# EAGLE design RG Matrix Driver (EAGLE 7.0.0)
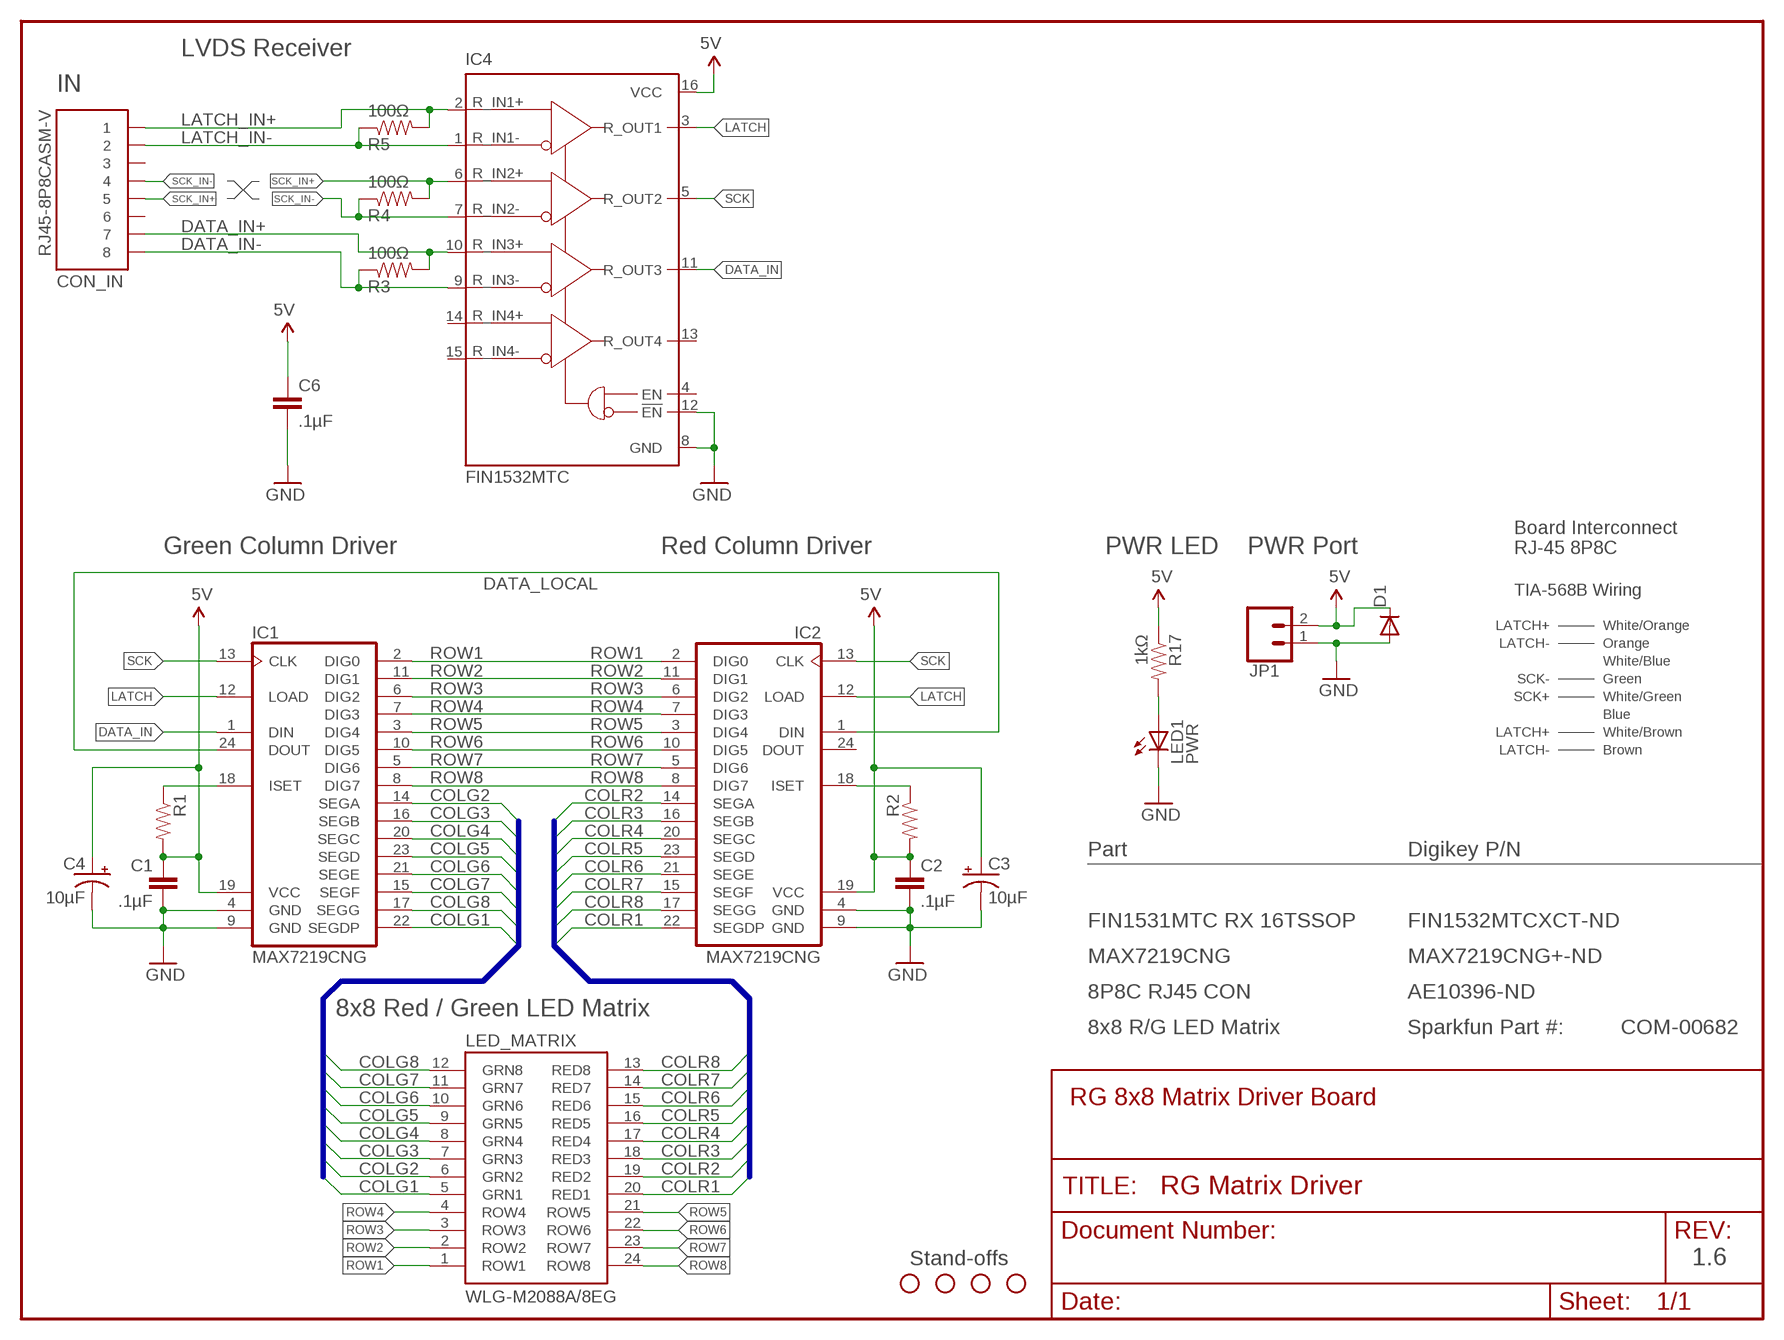
[diagram p0: schematic, sheet 1]

## Parts
C1  .1µF  CAP1206  [1206]
C2  .1µF  CAP1206  [1206]
C3  10µF  CAP_POLPTH2  [CPOL-RADIAL-10UF-25V]
C4  10µF  CAP_POLPTH2  [CPOL-RADIAL-10UF-25V]
C6  .1µF  CAP1206  [1206]
CON_IN  RJ45-8P8CASM-V  [RJ45-8P8C-ASM]
D1  DIODEPTH  [DIODE-1N4001]
IC1  MAX7219CNG  [DIL24-3]
IC2  MAX7219CNG  [DIL24-3]
IC4  FIN1532MTC  [TSSOP-16]
JP1  PWR  M02  [1X02_PC_SMD]
JP3  STAND-OFF  [STAND-OFF]
JP4  STAND-OFF  [STAND-OFF]
JP5  STAND-OFF  [STAND-OFF]
JP6  STAND-OFF  [STAND-OFF]
LED1  PWR  LED1206  [LED-1206]
LED_MATRIX  WLG-M2088A/8EG  [WLG-M2088A/8EG]
R1  RESISTOR1206  [1206]
R2  RESISTOR1206  [1206]
R3  100Ω  RESISTOR1206  [1206]
R4  100Ω  RESISTOR1206  [1206]
R5  100Ω  RESISTOR1206  [1206]
R17  1kΩ  RESISTOR1206  [1206]

## Nets
5V: C1.1 C2.1 C3.1(+) C4.1(+) C6.1 D1.C IC1.19(VCC) IC2.19(VCC) IC4.16(VCC) JP1.2 R1.2 R2.2 R17.1
COLG1: IC1.22(SEGDP) LED_MATRIX.5(GRN1)
COLG2: IC1.14(SEGA) LED_MATRIX.6(GRN2)
COLG3: IC1.16(SEGB) LED_MATRIX.7(GRN3)
COLG4: IC1.20(SEGC) LED_MATRIX.8(GRN4)
COLG5: IC1.23(SEGD) LED_MATRIX.9(GRN5)
COLG6: IC1.21(SEGE) LED_MATRIX.10(GRN6)
COLG7: IC1.15(SEGF) LED_MATRIX.11(GRN7)
COLG8: IC1.17(SEGG) LED_MATRIX.12(GRN8)
COLR1: IC2.22(SEGDP) LED_MATRIX.20(RED1)
COLR2: IC2.14(SEGA) LED_MATRIX.19(RED2)
COLR3: IC2.16(SEGB) LED_MATRIX.18(RED3)
COLR4: IC2.20(SEGC) LED_MATRIX.17(RED4)
COLR5: IC2.23(SEGD) LED_MATRIX.16(RED5)
COLR6: IC2.21(SEGE) LED_MATRIX.15(RED6)
COLR7: IC2.15(SEGF) LED_MATRIX.14(RED7)
COLR8: IC2.17(SEGG) LED_MATRIX.13(RED8)
DATA_IN: IC1.1(DIN) IC4.11(R_OUT3)
DATA_IN+: CON_IN.7 IC4.10(R_IN3+) R3.2
DATA_IN-: CON_IN.8 IC4.9(R_IN3-) R3.1
DATA_LOCAL: IC1.24(DOUT) IC2.1(DIN)
GISET: IC1.18(ISET) R1.1
GND: C1.2 C2.2 C3.2(-) C4.2(-) C6.2 D1.A IC1.4(GND) IC1.9(GND) IC2.4(GND) IC2.9(GND) IC4.8(GND) IC4.12(!EN) JP1.1 LED1.C
LATCH: IC1.12(LOAD) IC2.12(LOAD) IC4.3(R_OUT1)
LATCH_IN+: CON_IN.1 IC4.2(R_IN1+) R5.2
LATCH_IN-: CON_IN.2 IC4.1(R_IN1-) R5.1
LEDPWR: LED1.A R17.2
RISET: IC2.18(ISET) R2.1
ROW1: IC1.2(DIG0) IC2.2(DIG0) LED_MATRIX.1(ROW1)
ROW2: IC1.11(DIG1) IC2.11(DIG1) LED_MATRIX.2(ROW2)
ROW3: IC1.6(DIG2) IC2.6(DIG2) LED_MATRIX.3(ROW3)
ROW4: IC1.7(DIG3) IC2.7(DIG3) LED_MATRIX.4(ROW4)
ROW5: IC1.3(DIG4) IC2.3(DIG4) LED_MATRIX.21(ROW5)
ROW6: IC1.10(DIG5) IC2.10(DIG5) LED_MATRIX.22(ROW6)
ROW7: IC1.5(DIG6) IC2.5(DIG6) LED_MATRIX.23(ROW7)
ROW8: IC1.8(DIG7) IC2.8(DIG7) LED_MATRIX.24(ROW8)
SCK: IC1.13(CLK) IC2.13(CLK) IC4.5(R_OUT2)
SCK_IN+: CON_IN.5 IC4.6(R_IN2+) R4.2
SCK_IN-: CON_IN.4 IC4.7(R_IN2-) R4.1
Unconnected: CON_IN.3 CON_IN.6 IC2.24(DOUT) IC4.4(EN) IC4.13(R_OUT4) IC4.14(R_OUT4+) IC4.15(R_OUT4-)

## Buses
COLG[1..8],GRNCOL
COLR[1..8],REDCOL

## Notes on the sheet
- LVDS Receiver
- IN
- Green Column Driver | Red Column Driver | PWR LED | PWR Port
- Board Interconnect
  RJ-45 8P8C
- TIA-568B Wiring
- LATCH+ | White/Orange
- LATCH- | Orange
- White/Blue
- SCK- | Green
- SCK+ | White/Green
- Blue
- LATCH+ | White/Brown
- LATCH- | Brown
- Part | Digikey P/N
- FIN1531MTC RX 16TSSOP | FIN1532MTCXCT-ND
- MAX7219CNG | MAX7219CNG+-ND
- 8P8C RJ45 CON | AE10396-ND
- 8x8 Red / Green LED Matrix
- 8x8 R/G LED Matrix | Sparkfun Part #: | COM-00682
- RG 8x8 Matrix Driver Board
- Stand-offs | 1.6

## Library data of the parts
C1 C2 C6 = SparkFun-Capacitors:CAP: Capacitor Standard 0603 ceramic capacitor, and 0.1" leaded capacitor.
C3 C4 = SparkFun:CAP_POL: Capacitor Polarized These are standard SMD and PTH capacitors. Normally 10uF, 47uF, and 100uF in electrolytic and tantalum varieties. Always verify the external diameter of the through hole cap, it varies with capacity, voltage, and manufacturer. The EIA devices should be standard.
CON_IN = GetOffMyHack:RJ45-8P8C
D1 = SparkFun-DiscreteSemi:DIODE: Diode These are standard reverse protection diodes and small signal diodes. SMA package can handle up to about 1A. SOD-323 can handle about 200mA. What the SOD-323 package when ordering, there are some mfgs out there that are 5-pin packages.
IC1 IC2 = maxim:MAX7219CNG: LED DISPLAY DRIVER; MF: MAXIM; MPN: MAX7219CNG; OC_FARNELL: 1523914; OC_NEWARK: 34C4018
IC4 = GetOffMyHack:FIN1532: 5V Quad LVDS High Speed Differential Receiver
JP1 = GetOffMyHack:M02: Header 2 Standard 2-pin 0.1" header. Use with straight break away headers (SKU : PRT-00116), right angle break away headers (PRT-00553), swiss pins (PRT-00743), machine pins (PRT-00117), and female headers (PRT-00115). Molex polarized connector foot print use with SKU : PRT-08233 with associated crimp pins and housings.
JP3-JP6 = SparkFun:STAND-OFF: Stand Off This is the mechanical footprint for a #4 phillips button head screw. Use the keepout ring to avoid running the screw head into surrounding components. SKU : PRT-00447
LED1 = SparkFun:LED: LEDs Standard schematic elements and footprints for 5mm, 3mm, 1206, and 0603 sized LEDs. 5mm - Spark Fun Electronics SKU : COM-00529 (and others)
LED_MATRIX = led-matrix-v3:WLG-M2088A/8EG: LED Matrix - Dual Color (Red + Green) - Medium sku: COM-00682 0.33 x 2 x 2"
R1-R5 = SparkFun-Resistors:RESISTOR: Resistor Basic schematic elements and footprints for 0603, 1206, and PTH resistors.
R17 = SparkFun:RESISTOR: Resistor Basic schematic elements and footprints for 0603, 1206, and PTH resistors.

## Board
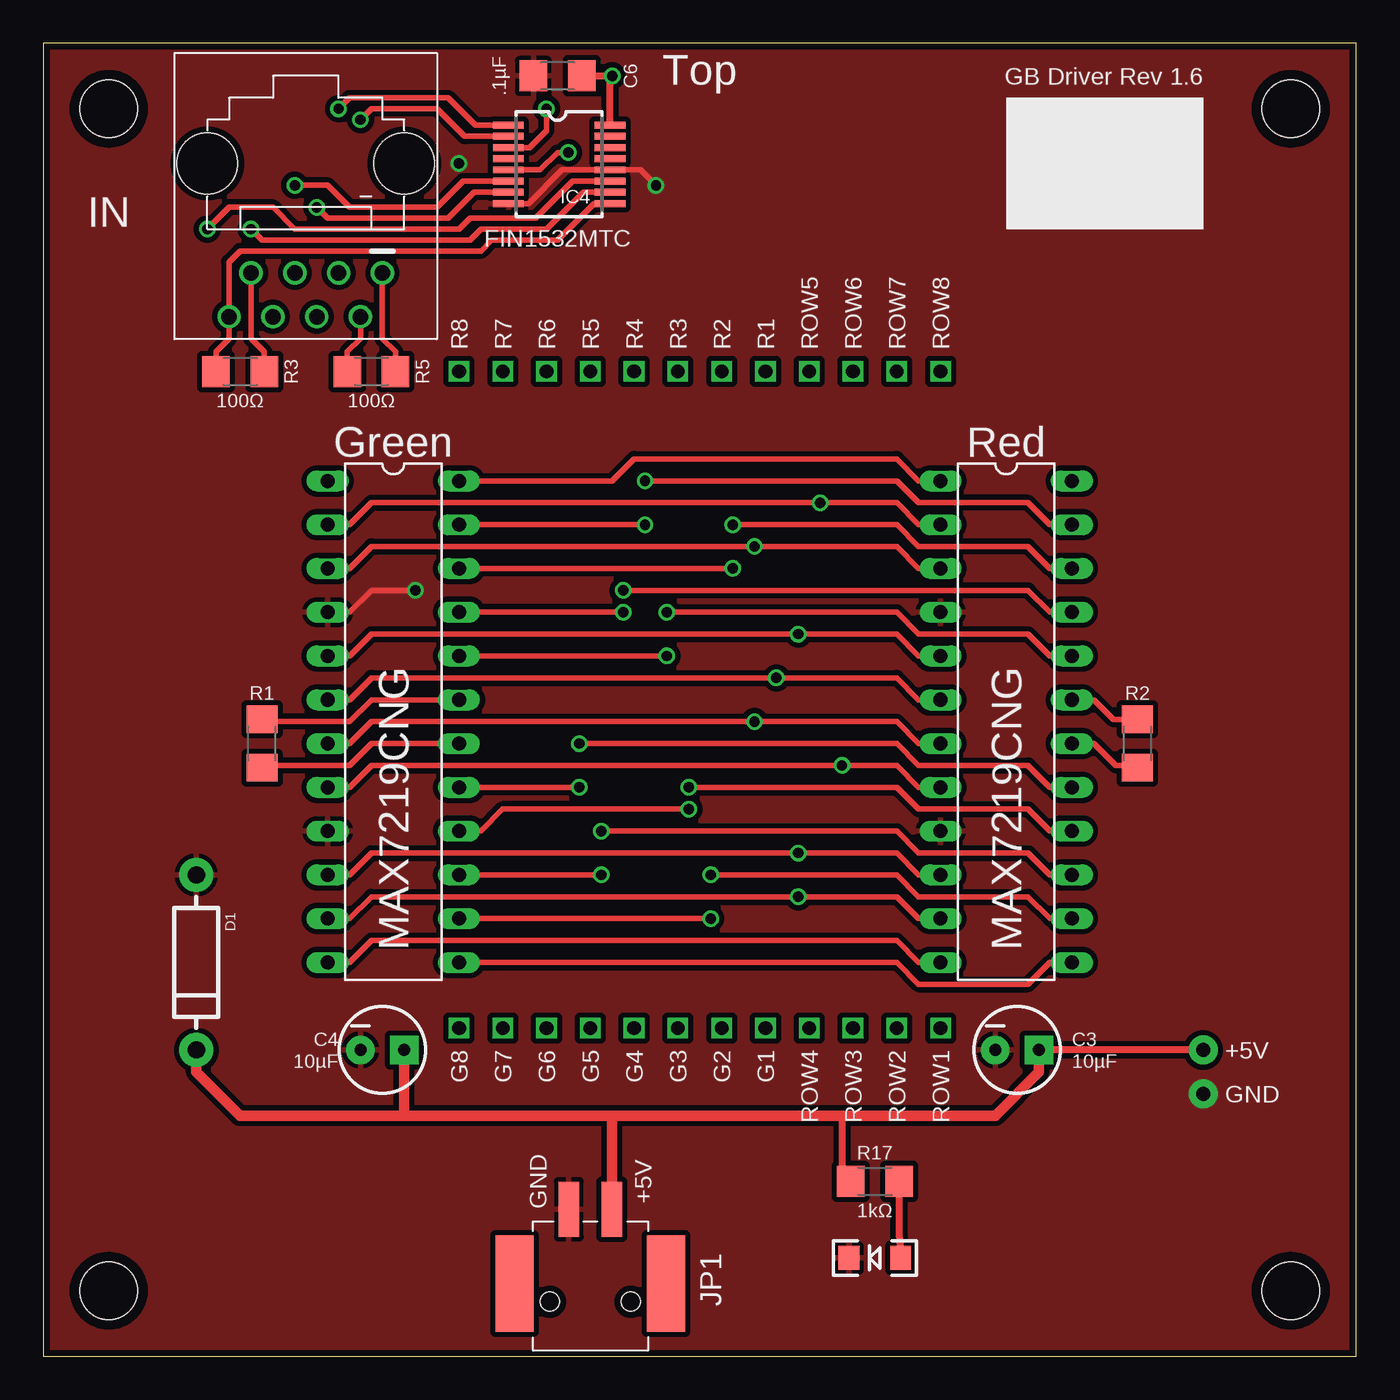
[diagram p1: board, top side]
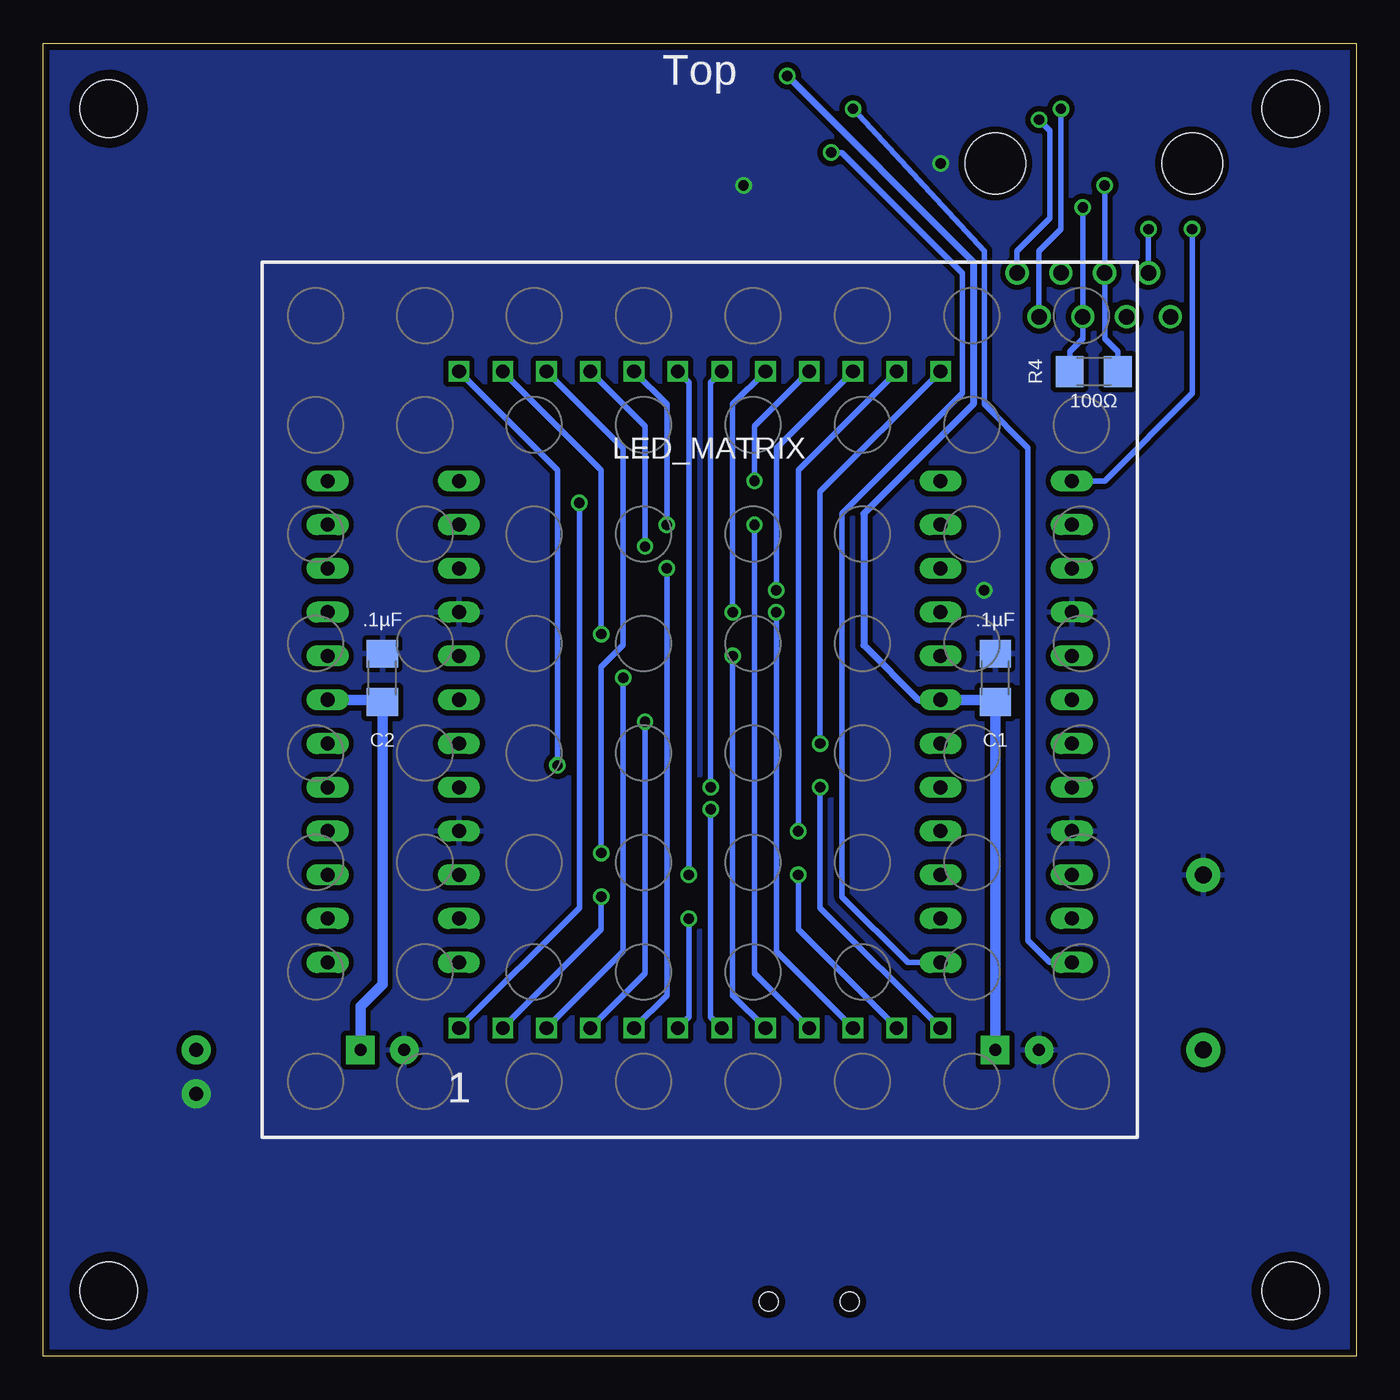
[diagram p2: board, bottom side, seen from below]

Size 76.2 x 76.2 mm. Coordinates in mm from the lower left corner, seen from the top.
Outline: 0,0 76.2,0 76.2,76.2 0,76.2 0,0
Copper layers (1*16): Top 0.0356mm / dielectric 1.5011mm / Bottom 0.0356mm
Design rules "LaenPCBOrder": minimum track width 6mil, minimum drill 13mil, track to track 6mil, track to pad 6mil, pad to pad 6mil, via to via 6mil, smd to smd 6mil, copper to edge 15mil, drill to drill 6mil, minimum pad ring 7mil, minimum via ring 7mil, stop-mask expansion 3mil, vias tented up to drill 0mil, thermal gap 10mil

### Footprints (pad centres in the part's own frame; a part is rotated, then mirrored left to right if it is on the bottom)
1206 = smd 1.6 x 1.8: 1 -1.4,0; 2 1.4,0
CPOL-RADIAL-10UF-25V = drill 0.7 pad 1.651 square: 1 1.27,0 | drill 0.7 pad 1.651: 2 -1.27,0
RJ45-8P8C-ASM = drill 0.9: 1 -4.445,4.445; 2 -3.175,6.985; 3 -1.905,4.445; 4 -0.635,6.985; 5 0.635,4.445; 6 1.905,6.985; 7 3.175,4.445; 8 4.445,6.985 | hole 3.5: 5.715,-1.905; -5.715,-1.905
DIODE-1N4001 = drill 1 pad 1.981: A -5.08,0; C 5.08,0
DIL24-3 = drill 0.813 long: 1 -13.97,-3.81; 2 -11.43,-3.81; 3 -8.89,-3.81; 4 -6.35,-3.81; 5 -3.81,-3.81; 6 -1.27,-3.81; 7 1.27,-3.81; 8 3.81,-3.81; 9 6.35,-3.81; 10 8.89,-3.81; 11 11.43,-3.81; 12 13.97,-3.81; 13 13.97,3.81; 14 11.43,3.81; 15 8.89,3.81; 16 6.35,3.81; 17 3.81,3.81; 18 1.27,3.81; 19 -1.27,3.81; 20 -3.81,3.81; 21 -6.35,3.81; 22 -8.89,3.81; 23 -11.43,3.81; 24 -13.97,3.81
TSSOP-16 = smd 0.4 x 1.78: 1 -2.225,-2.85; 2 -1.575,-2.85; 3 -0.925,-2.85; 4 -0.275,-2.85; 5 0.375,-2.85; 6 1.025,-2.85; 7 1.675,-2.85; 8 2.325,-2.85; 9 2.325,3.05; 10 1.675,3.05; 11 1.025,3.05; 12 0.375,3.05; 13 -0.275,3.05; 14 -0.925,3.05; 15 -1.575,3.05; 16 -2.225,3.05
1X02_PC_SMD = smd 1.2 x 3.2: 1 -1.25,3.45; 2 1.25,3.45 | smd 2.2 x 5.6: P$3 4.4,-0.85; P$4 -4.4,-0.85 | hole 1.1: -2.35,-1.9; 2.35,-1.9
STAND-OFF = hole 3.302: 0,0
LED-1206 = smd 1.2 x 1.4: A -1.5,0; C 1.5,0
WLG-M2088A/8EG = drill 0.8 square: 1 -13.97,-19.05; 2 -11.43,-19.05; 3 -8.89,-19.05; 4 -6.35,-19.05; 5 -3.81,-19.05; 6 -1.27,-19.05; 7 1.27,-19.05; 8 3.81,-19.05; 9 6.35,-19.05; 10 8.89,-19.05; 11 11.43,-19.05; 12 13.97,-19.05; 13 13.97,19.05; 14 11.43,19.05; 15 8.89,19.05; 16 6.35,19.05; 17 3.81,19.05; 18 1.27,19.05; 19 -1.27,19.05; 20 -3.81,19.05; 21 -6.35,19.05; 22 -8.89,19.05; 23 -11.43,19.05; 24 -13.97,19.05

### Placement (x,y rotation side)
C1  20.95,39.37 90 bottom
C2  56.52,39.37 90 bottom
C3  56.52,17.78 0 top
C4  19.68,17.78 0 top
C6  29.84,74.3 180 top
CON_IN  15.24,67.31 180 top
D1  8.89,22.86 270 top
IC1  20.32,36.83 270 top
IC2  55.88,36.83 270 top
IC4  29.84,69.22 270 top
JP1  31.75,5.08 0 top
JP3  3.81,3.81 0 top
JP4  72.39,72.39 0 top
JP5  3.81,72.39 0 top
JP6  72.39,3.81 0 top
LED1  48.26,5.71 180 top
LED_MATRIX  38.1,38.1 0 bottom
R1  12.7,35.56 90 top
R2  63.5,35.56 90 top
R3  11.43,57.15 0 top
R4  15.24,57.15 0 bottom
R5  19.05,57.15 0 top
R17  48.26,10.16 0 top

### Tracks (layer width: path | path; a pad name or v marks a point on that pad's centre or on a via)
5V  (via drill 0.6, 0.8 pad 1.68)
  Top 0.305: IC1.19 19.05,38.1 17.78,36.83 12.83,36.83 R1.2 | R2.2 62.1,36.96 60.96,38.1 IC2.19
  Top 0.406: IC4.16 32.9,74.17 v33.02,74.3 C6.1 | 46.35,13.97 46.35,10.66 R17.1 | v67.31,17.78 C3.1
  Top 0.61: C3.1 57.78,16.51 55.24,13.97 46.35,13.97 31.75,13.97 | 20.95,13.97 C4.1 | JP1.2 33,13.95 31.75,13.97 | 31.75,13.97 11.43,13.97 8.89,16.51 D1.C
  Bottom 0.406: 55.88,38.1 56.38,38.1 C2.1 | v33.02,74.3 22.23,63.5 22.23,55.24 28.57,48.9 28.57,41.27 25.4,38.1 IC1.19
  Bottom 0.61: C4.1 C1.1 21.09,38.1 IC1.19 | C3.1 57.78,20.32 56.52,21.59 C2.1 56.65,38.1 IC2.19
COLG1  (via drill 0.6)
  Top 0.305: v40.01,45.72 IC1.22
  Bottom 0.305: LED_MATRIX.5 40.01,20.95 v40.01,45.72
COLG2  (via drill 0.6)
  Top 0.305: v38.73,25.4 IC1.14
  Bottom 0.305: LED_MATRIX.6 38.73,19.68 v38.73,25.4
COLG3  (via drill 0.6)
  Top 0.305: v37.47,31.75 26.67,31.75 25.4,30.48 IC1.16
  Bottom 0.305: LED_MATRIX.7 37.47,19.68 v37.47,31.75
COLG4  (via drill 0.6)
  Top 0.305: v36.2,40.64 IC1.20
  Bottom 0.305: LED_MATRIX.8 36.2,20.95 v36.2,40.64
COLG5  (via drill 0.6)
  Top 0.305: v34.92,48.26 IC1.23
  Bottom 0.305: LED_MATRIX.9 34.92,22.23 v34.92,48.26
COLG6  (via drill 0.6)
  Top 0.305: v33.66,43.18 IC1.21
  Bottom 0.305: LED_MATRIX.10 33.66,23.5 v33.66,43.18
COLG7  (via drill 0.6)
  Top 0.305: v32.38,27.94 IC1.15
  Bottom 0.305: LED_MATRIX.11 32.38,24.77 v32.38,27.94
COLG8  (via drill 0.6)
  Top 0.305: v31.11,33.02 IC1.17
  Bottom 0.305: LED_MATRIX.12 31.11,26.04 v31.11,33.02
COLR1  (via drill 0.6)
  Top 0.305: IC2.22 58.42,45.72 57.15,46.99 50.8,46.99 49.53,48.26 v40.01,48.26
  Bottom 0.305: LED_MATRIX.20 40.01,55.24 v40.01,48.26
COLR2  (via drill 0.6)
  Top 0.305: v38.73,27.94 49.53,27.94 50.8,26.67 57.15,26.67 58.42,25.4 IC2.14
  Bottom 0.305: LED_MATRIX.19 38.73,56.52 v38.73,27.94
COLR3  (via drill 0.6)
  Top 0.305: v37.47,33.02 49.53,33.02 50.8,31.75 57.15,31.75 58.42,30.48 IC2.16
  Bottom 0.305: LED_MATRIX.18 37.47,56.52 v37.47,33.02
COLR4  (via drill 0.6)
  Top 0.305: v36.2,43.18 49.53,43.18 50.8,41.91 57.15,41.91 58.42,40.64 IC2.20
  Bottom 0.305: v36.2,43.18 36.2,55.24 LED_MATRIX.17
COLR5  (via drill 0.6)
  Top 0.305: IC2.23 58.42,48.26 57.15,49.53 50.8,49.53 49.53,50.8 v34.92,50.8
  Bottom 0.305: LED_MATRIX.16 34.92,53.98 v34.92,50.8
COLR6  (via drill 0.6)
  Top 0.305: IC2.21 58.42,43.18 57.15,44.45 v33.66,44.45
  Bottom 0.305: LED_MATRIX.15 33.66,52.7 v33.66,44.45
COLR7  (via drill 0.6)
  Top 0.305: v32.38,30.48 49.53,30.48 50.8,29.21 57.15,29.21 58.42,27.94 IC2.15
  Bottom 0.305: LED_MATRIX.14 32.38,51.44 v32.38,30.48
COLR8  (via drill 0.6)
  Top 0.305: v31.11,35.56 49.53,35.56 50.8,34.29 57.15,34.29 58.42,33.02 IC2.17
  Bottom 0.305: LED_MATRIX.13 31.11,50.16 v31.11,35.56
DATA_IN  (via drill 0.6)
  Top 0.305: IC4.11 30.73,68.19 28.57,66.04 24.77,66.04 24.13,65.41 14.61,65.41 13.34,66.67 10.79,66.67 v9.53,65.41
  Bottom 0.305: IC1.1 14.61,50.8 9.53,55.88 v9.53,65.41
DATA_IN+  (via drill 0.6)
  Top 0.305: R3.2 12.83,58.29 12.06,59.05 CON_IN.7 | IC4.10 31.34,67.54 29.21,65.41 25.4,65.41 24.77,64.77 12.7,64.77 v12.06,65.41
  Bottom 0.305: CON_IN.7 v12.06,65.41
DATA_IN-
  Top 0.305: R3.1 10.03,58.29 10.79,59.05 CON_IN.8 10.79,63.5 11.43,64.14 25.4,64.14 26.04,64.77 29.84,64.77 31.96,66.89 IC4.9
DATA_LOCAL
  Top 0.305: IC1.24 33.02,50.8 34.29,52.07 49.53,52.07 50.8,50.8 IC2.1
GISET
  Top 0.305: IC1.18 19.05,35.56 17.78,34.29 12.83,34.29 R1.1
GND  (via drill 0.6, 0.8 pad 1.68)
  Top 0.305: IC4.8 28.16,66.89 30.11,68.84 IC4.12 34.66,68.84 v35.56,67.94 | IC1.4 17.78,43.18 19.05,44.45 v21.59,44.45
  other vias: 67.31,15.24 24.13,69.22
  pour Top (isolate 0.305): 0,76.2 0,0 76.2,0 76.2,76.2
  pour Bottom (isolate 0.305): 0,76.2 0,0 76.2,0 76.2,76.2
LATCH  (via drill 0.6)
  Top 0.305: IC1.12 17.78,22.86 19.05,24.13 49.53,24.13 50.8,22.86 IC2.12 | IC4.3 28.23,70.14 29.21,71.12 v29.21,72.39
  Bottom 0.305: IC1.12 17.78,22.86 19.05,24.13 19.05,52.7 21.59,55.24 21.59,64.14 v29.21,72.39
LATCH_IN+  (via drill 0.6)
  Top 0.305: R5.2 20.45,58.29 19.68,59.05 CON_IN.1 | IC4.2 24.46,70.79 22.86,72.39 19.05,72.39 v18.41,71.75
  Bottom 0.305: v18.41,71.75 17.78,71.12 17.78,66.04 19.68,64.14 CON_IN.1
LATCH_IN-  (via drill 0.6)
  Top 0.305: R5.1 17.65,58.29 18.41,59.05 CON_IN.2 | v17.14,72.39 17.78,73.03 23.5,73.03 25.08,71.44 IC4.1
  Bottom 0.305: CON_IN.2 18.41,64.14 17.14,65.41 v17.14,72.39
LEDPWR
  Top 0.406: R17.2 49.66,7.08 LED1.A
RISET
  Top 0.305: IC2.18 60.96,35.56 62.23,34.29 63.37,34.29 R2.1
ROW1  (via drill 0.6)
  Top 0.305: IC1.2 17.78,48.26 19.05,49.53 v45.09,49.53 49.53,49.53 50.8,48.26 IC2.2
  Bottom 0.305: LED_MATRIX.1 45.09,26.04 v45.09,49.53
ROW2  (via drill 0.6)
  Top 0.305: IC1.11 17.78,25.4 19.05,26.67 v43.81,26.67 49.53,26.67 50.8,25.4 IC2.11
  Bottom 0.305: LED_MATRIX.2 43.81,24.77 v43.81,26.67
ROW3  (via drill 0.6)
  Top 0.305: IC1.6 17.78,38.1 19.05,39.37 v42.55,39.37 49.53,39.37 50.8,38.1 IC2.6
  Bottom 0.305: LED_MATRIX.3 42.55,23.5 v42.55,39.37
ROW4  (via drill 0.6)
  Top 0.305: IC1.7 17.78,35.56 19.05,36.83 v41.27,36.83 49.53,36.83 50.8,35.56 IC2.7
  Bottom 0.305: LED_MATRIX.4 41.27,22.23 v41.27,36.83
ROW5  (via drill 0.6)
  Top 0.305: IC1.3 17.78,45.72 19.05,46.99 v41.27,46.99 49.53,46.99 50.8,45.72 IC2.3
  Bottom 0.305: LED_MATRIX.21 41.27,53.98 v41.27,46.99
ROW6  (via drill 0.6)
  Top 0.305: IC1.10 17.78,27.94 19.05,29.21 v43.81,29.21 49.53,29.21 50.8,27.94 IC2.10
  Bottom 0.305: LED_MATRIX.22 42.55,52.7 42.55,41.27 43.81,40.01 v43.81,29.21
ROW7  (via drill 0.6)
  Top 0.305: IC1.5 17.78,40.64 19.05,41.91 v43.81,41.91 49.53,41.91 50.8,40.64 IC2.5
  Bottom 0.305: LED_MATRIX.23 43.81,51.44 v43.81,41.91
ROW8  (via drill 0.6)
  Top 0.305: IC1.8 17.78,33.02 19.05,34.29 v46.35,34.29 49.53,34.29 50.8,33.02 IC2.8
  Bottom 0.305: LED_MATRIX.24 46.35,51.44 v46.35,34.29
SCK  (via drill 0.6)
  Top 0.305: v30.48,69.85 29.84,69.85 28.84,68.84 IC4.5 | IC2.13 58.42,22.86 57.15,21.59 50.8,21.59 49.53,22.86 IC1.13
  Bottom 0.305: IC1.13 26.04,22.86 29.84,26.67 29.84,48.9 22.86,55.88 22.86,62.87 29.84,69.85 v30.48,69.85
SCK_IN+  (via drill 0.6)
  Top 0.305: v14.61,67.94 16.51,67.94 17.78,66.67 22.86,66.67 24.38,68.19 IC4.6
  Bottom 0.305: v14.61,67.94 CON_IN.5 14.61,59.05 13.84,58.29 R4.2
SCK_IN-  (via drill 0.6)
  Top 0.305: v15.88,66.67 16.51,66.04 23.5,66.04 25,67.54 IC4.7
  Bottom 0.305: v15.88,66.67 CON_IN.4 15.88,59.05 16.64,58.29 R4.1

### Text on the board
_tsilk: Top | GB Driver Rev 1.6 | IN | R8 | R7 | R6 | R5 | R4 | R3 | R2 | R1 | ROW5 | ROW6 | ROW7 | ROW8 | Green | Red | G8 | G7 | G6 | G5 | G4 | G3 | G2 | G1 | ROW4 | ROW3 | ROW2 | ROW1 | +5V | GND | GND | +5V
_bsilk: Top | 1